# EAGLE design Lightpack5.5L (EAGLE 6.2)
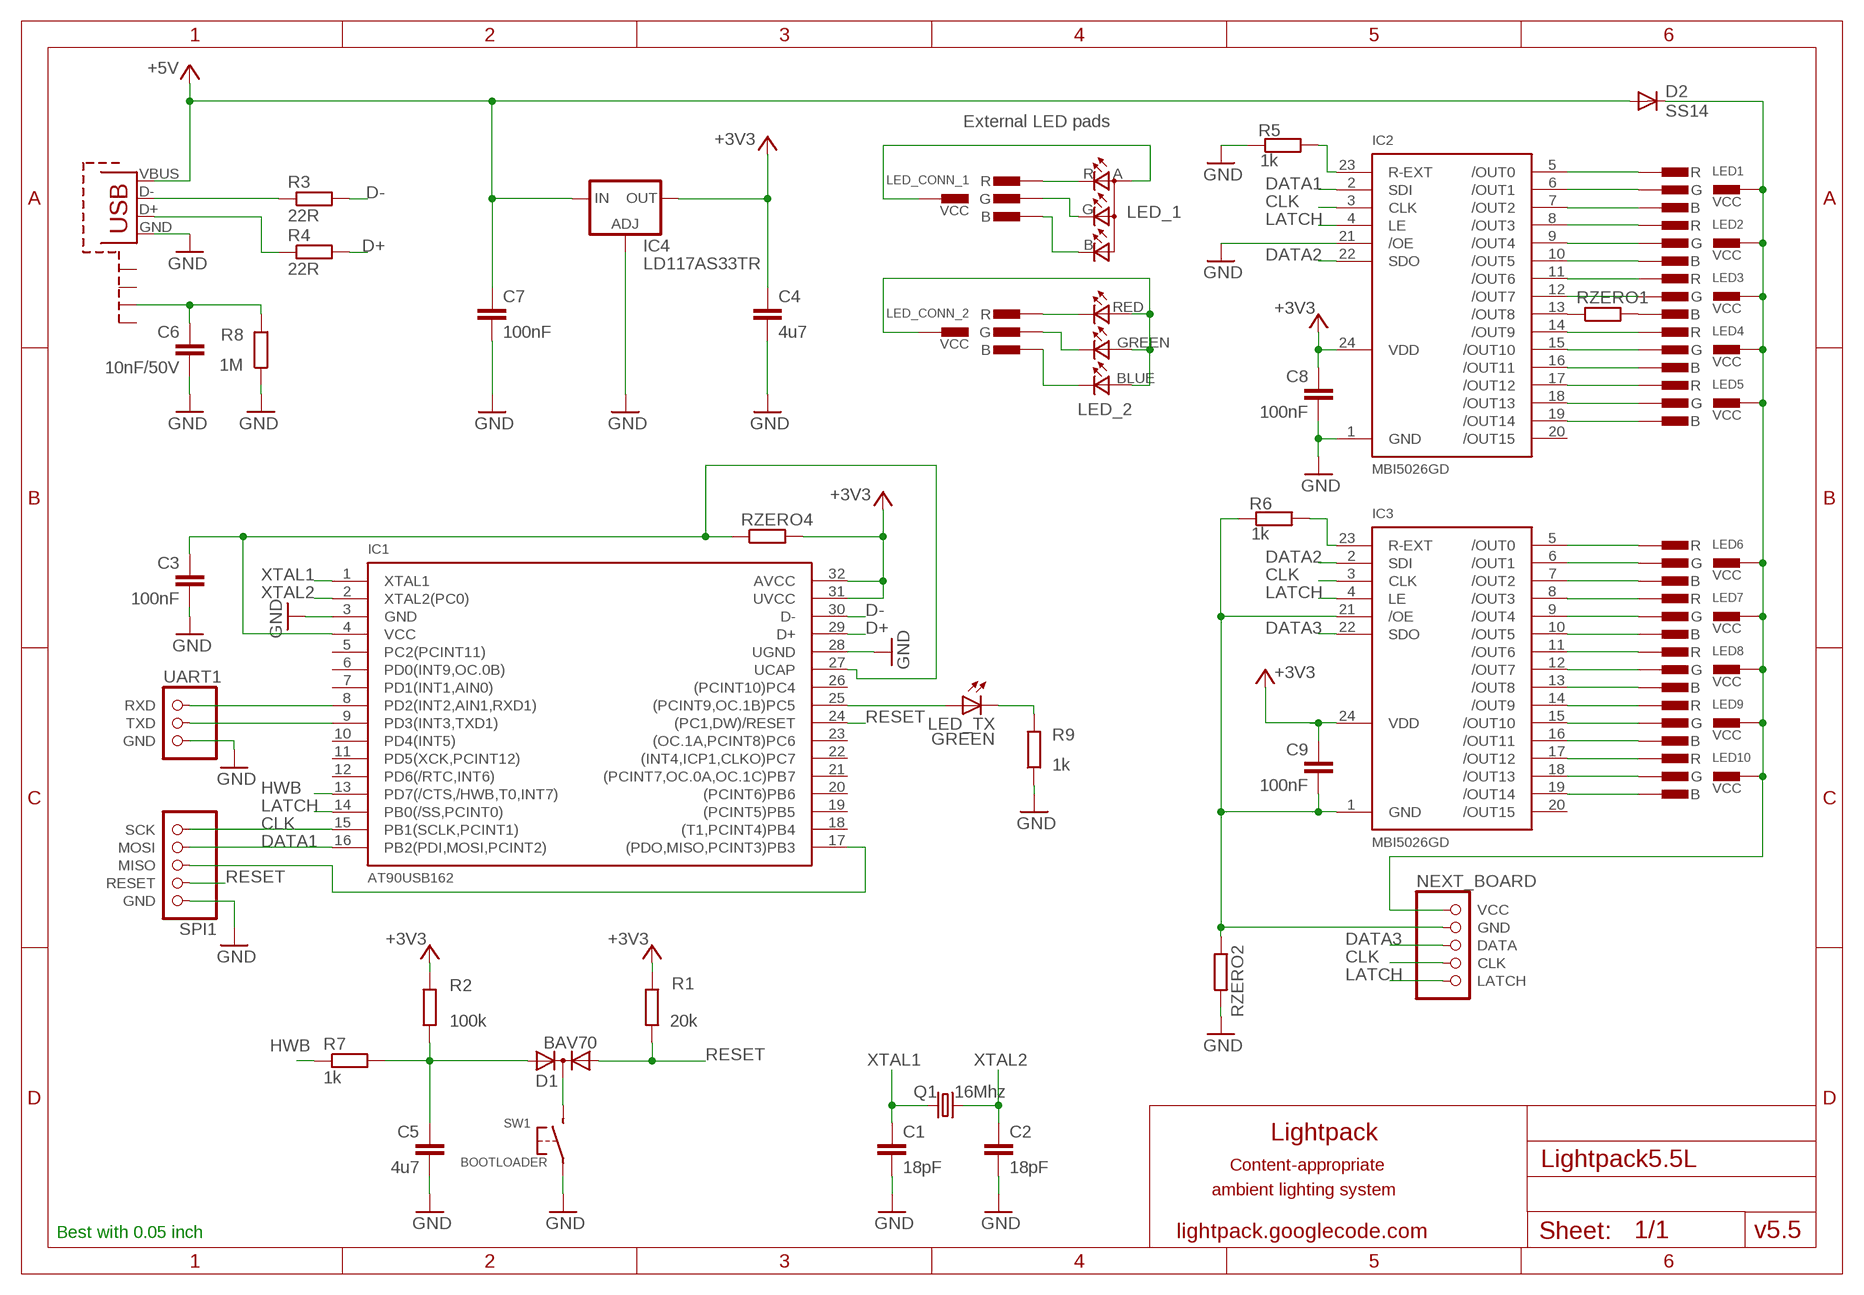
[diagram p0: schematic, sheet 1]

## Parts
C1  18pF  C-EUC1206  [C1206]
C2  18pF  C-EUC1206  [C1206]
C3  100nF  C-EUC1206  [C1206]
C4  4u7  C-EUC1206  [C1206]
C5  4u7  C-EUC1206  [C1206]
C6  10nF/50V  C-EUC1206  [C1206]
C7  100nF  C-EUC1206  [C1206]
C8  100nF  C-EUC1206  [C1206]
C9  100nF  C-EUC1206  [C1206]
D1  BAV70  DIODE-2AC|CASOT23  [SOT23]
D2  SS14  DIODE-SMB  [SMB]
IC1  AT90USB162  [TQFP32]
IC2  MBI5026GD  [SOP24-300-1.27]
IC3  MBI5026GD  [SOP24-300-1.27]
IC4  LD117AS33TR  [SOT223]
LED1  CON-RGB-LED  [CON-RGB-LED]
LED2  CON-RGB-LED  [CON-RGB-LED]
LED3  CON-RGB-LED  [CON-RGB-LED]
LED4  CON-RGB-LEDVCC-INDENT  [CON-RGB-LED-WITH-VCC-INDENT]
LED5  CON-RGB-LEDVCC-INDENT  [CON-RGB-LED-WITH-VCC-INDENT]
LED6  CON-RGB-LED  [CON-RGB-LED]
LED7  CON-RGB-LED  [CON-RGB-LED]
LED8  CON-RGB-LED  [CON-RGB-LED]
LED9  CON-RGB-LED  [CON-RGB-LED]
LED10  CON-RGB-LED  [CON-RGB-LED]
LED_1  CLV1A-FKB  [CLV1A-FKB]
LED_2  TOPLED-3SMD5X5  [SMD-RGB-5X5]
LED_CONN_1  CON-RGB-LED  [CON-RGB-LED]
LED_CONN_2  CON-RGB-LED  [CON-RGB-LED]
LED_TX  GREEN  LEDCHIPLED_0805  [CHIPLED_0805]
NEXT_BOARD  LED_DRIVER_BOARD  [DATA-CLK-LATCH]
Q1  16Mhz  CRYSTALHC49UP  [HC49UP]
R1  20k  R-EU_R1206  [R1206]
R2  100k  R-EU_R1206_2  [R1206]
R3  22R  R-EU_R1206  [R1206]
R4  22R  R-EU_R1206  [R1206]
R5  1k  R-EU_R1206  [R1206]
R6  1k  R-EU_R1206  [R1206]
R7  1k  R-EU_R1206  [R1206]
R8  1M  R-EU_R1206  [R1206]
R9  1k  R-EU_R1206  [R1206]
RZERO1  R-EU_R1206_2  [R1206]
RZERO2  0  R-EU_R1206_2  [R1206]
RZERO4  R-EU_R1206_2  [R1206]
SPI1  SPI_RST_GND_CONN  [SPI_5]
SW1  BOOTLOADER  BUTTON  [BUTTON-SMD]
UART1  UART  [UART]
X1  USB-MB-S  [USB-MB-S]

## Nets
+3V3: C4.1 C8.1 C9.1 IC1.31(UVCC) IC1.32(AVCC) IC2.24(VDD) IC3.24(VDD) IC4.4(OUT) R1.2 R2.1 RZERO4.1
+5V [VCC]: C7.1 D2.A IC4.3(IN) X1.VBUS
CLK: IC1.15(PB1(SCLK,PCINT1)) IC2.3(CLK) IC3.3(CLK) NEXT_BOARD.CLK SPI1.SCK
D+: IC1.29(D+) R4.2
D-: IC1.30(D-) R3.2
DATA1: IC1.16(PB2(PDI,MOSI,PCINT2)) IC2.2(SDI) SPI1.MOSI
DATA2: IC2.22(SDO) IC3.2(SDI)
DATA3: IC3.22(SDO) NEXT_BOARD.DATA
GND: C1.2 C2.2 C3.2 C4.2 C5.2 C6.2 C7.2 C8.2 IC1.3(GND) IC1.28(UGND) IC2.1(GND) IC2.21(/OE) IC4.1(ADJ) R5.1 R8.1 R9.1 RZERO2.1 SPI1.GND SW1.1 UART1.GND X1.GND
HWB: IC1.13(PD7(/CTS,/HWB,T0,INT7)) R7.1
LATCH: IC1.14(PB0(/SS,PCINT0)) IC2.4(LE) IC3.4(LE) NEXT_BOARD.LATCH
N$1: IC2.23(R-EXT) R5.2
N$2: IC3.8(/OUT3) LED7.R
N$3: IC1.17((PDO,MISO,PCINT3)PB3) SPI1.MISO
N$4: IC1.8(PD2(INT2,AIN1,RXD1)) UART1.RXD
N$5: IC2.5(/OUT0) LED1.R
N$6: IC2.6(/OUT1) LED1.G
N$7: IC2.7(/OUT2) LED1.B
N$8: IC1.25((PCINT9,OC.1B)PC5) LED_TX.A
N$9: IC2.8(/OUT3) LED2.R
N$10: IC2.9(/OUT4) LED2.G
N$11: IC2.10(/OUT5) LED2.B
N$12: IC2.11(/OUT6) LED3.R
N$13: IC2.12(/OUT7) LED3.G
N$14: IC2.13(/OUT8) RZERO1.2
N$15: IC2.14(/OUT9) LED4.R
N$16: IC1.9(PD3(INT3,TXD1)) UART1.TXD
N$17: LED_1.R(CRED) LED_CONN_1.R
N$18: IC3.5(/OUT0) LED6.R
N$19: IC3.6(/OUT1) LED6.G
N$20: IC3.7(/OUT2) LED6.B
N$21: IC3.9(/OUT4) LED7.G
N$22: IC3.10(/OUT5) LED7.B
N$23: IC3.11(/OUT6) LED8.R
N$24: IC3.12(/OUT7) LED8.G
N$25: IC3.14(/OUT9) LED9.R
N$26: IC3.13(/OUT8) LED8.B
N$27: IC3.15(/OUT10) LED9.G
N$28: IC3.16(/OUT11) LED9.B
N$29: IC2.15(/OUT10) LED4.G
N$30: IC2.16(/OUT11) LED4.B
N$31: IC3.23(R-EXT) R6.2
N$32: R3.1 X1.D-
N$33: R4.1 X1.D+
N$34: LED_1.G(CGREEN) LED_CONN_1.G
N$35: LED_1.B(CBLUE) LED_CONN_1.B
N$36: LED_1.A(ANODE) LED_CONN_1.VCC
N$37: LED_TX.C R9.2
N$38: IC2.17(/OUT12) LED5.R
N$39: IC2.18(/OUT13) LED5.G
N$40: IC2.19(/OUT14) LED5.B
N$41: IC3.17(/OUT12) LED10.R
N$42: IC3.18(/OUT13) LED10.G
N$43: IC3.19(/OUT14) LED10.B
N$44: C6.1 R8.2 X1.SHIELD3
N$45: D1.3(C) SW1.2
N$47: C5.1 D1.2(A2) R2.2 R7.2
N$48: C9.2 IC3.1(GND) IC3.21(/OE) NEXT_BOARD.GND R6.1 RZERO2.2
N$49: LED3.B RZERO1.1
N$50: LED_2.CRED LED_CONN_2.R
N$51: LED_2.CGREEN LED_CONN_2.G
N$52: LED_2.CBLUE LED_CONN_2.B
N$53: C3.1 IC1.4(VCC) IC1.27(UCAP) RZERO4.2
N$54: LED_2.BLUE LED_2.GREEN LED_2.RED LED_CONN_2.VCC
N$57 [VCC]: D2.C LED1.VCC LED2.VCC LED3.VCC LED4.VCC LED5.VCC LED6.VCC LED7.VCC LED8.VCC LED9.VCC LED10.VCC NEXT_BOARD.VCC
RESET: D1.1(A1) IC1.24((PC1,DW)/RESET) R1.1 SPI1.RESET
XTAL1: C1.1 IC1.1(XTAL1) Q1.1
XTAL2: C2.1 IC1.2(XTAL2(PC0)) Q1.2
Unconnected: IC1.5(PC2(PCINT11)) IC1.6(PD0(INT9,OC.0B)) IC1.7(PD1(INT1,AIN0)) IC1.10(PD4(INT5)) IC1.11(PD5(XCK,PCINT12)) IC1.12(PD6(/RTC,INT6)) IC1.18((T1,PCINT4)PB4) IC1.19((PCINT5)PB5) IC1.20((PCINT6)PB6) IC1.21((PCINT7,OC.0A,OC.1C)PB7) IC1.22((INT4,ICP1,CLKO)PC7) IC1.23((OC.1A,PCINT8)PC6) IC1.26((PCINT10)PC4) IC2.20(/OUT15) IC3.20(/OUT15) X1.SHIELD1 X1.SHIELD2 X1.SHIELD4

## Notes on the sheet
- External LED pads
- Lightpack
- Content-appropriate
- ambient lighting system
- Best with 0.05 inch | lightpack.googlecode.com | v5.5

## Library data of the parts
C1-C9 = rcl:C-EU: CAPACITOR, European symbol
D1 = diode:DIODE-2AC|CA: Dual DIODE Anode-Cathode|Cathode-Anode
D2 = diode:DIODE-: DIODE
IC1 = AT90USB:AT90USB162: AT90USB162 Author: brunql.github.com
IC2 IC3 = MBI5026:MBI5026: MBI5026 Author: brunql.github.com
IC4 = v-reg:LD117A?*: Low drop fixed and adjustable positive voltage regulators 1 A Source: http://www.st.com/stonline/products/literature/ds/7194/ld1117axx.pdf
LED1-LED3 LED6-LED10 LED_CONN_1 LED_CONN_2 = led-rgb:CON-RGB-LED
LED4 LED5 = br-led-rgb:CON-RGB-LED
LED_1 = led-rgb:CLV1A-FKB: Chip LED RGB Source: http://document.sharpsma.com/files/GM1WA55311A_SS.pdf
LED_2 = br-led-rgb:TOPLED-3: OSRAM Edited: brunql Removed center pad in pcb - Hyper Multi TOPLED® (RGB) LB E673, LV E673, LT E673 - Power TOPLED® Enhanced optical Power LED (HOP2000) LS E67B, LA E67B, LO E67B, LY E67B - Hyper Multi TOPLED® Enhanced optical Power LED (HOP2000 / ATON®) LATB T66B - Hyper Multi TOPLED® Hyper-Bright LED LATB T686 Source: http://www.osram.convergy.de/
LED_TX = led:LED: LED OSRAM: - CHIPLED LG R971, LG N971, LY N971, LG Q971, LY Q971, LO R971, LY R971 LH N974, LH R974 LS Q976, LO Q976, LY Q976 LO Q996 - Hyper CHIPLED LW Q18S LB Q993, LB Q99A, LB R99A - SideLED LS A670, LO A670, LY A670, LG A670, LP A670 LB A673, LV A673, LT A673, LW A673 LH A674 LY A675 LS A676, LA A676, LO A676, LY A676, LW A676 LS A679, LY A679, LG A679 - Hyper Micro SIDELED® LS Y876, LA Y876, LO Y876, LY Y876 LT Y87S - SmartLED LW L88C, LW L88S LB L89C, LB L89S, LG L890 LS L89K, LO L89K, LY L89K LS L896, LA L896, LO L896, LY L896 - TOPLED LS T670, LO T670, LY T670, LG T670, LP T670 LSG T670, LSP T670, LSY T670, LOP T670, LYG T670 LG T671, LOG T671, LSG T671 LB T673, LV T673, LT T673, LW T673 LH T674 LS T676, LA T676, LO T676, LY T676, LB T676, LH T676, LSB T676, LW T676 LB T67C, LV T67C, LT T67C, LS T67K, LO T67K, LY T67K, LW E67C LS E67B, LA E67B, LO E67B, LY E67B, LB E67C, LV E67C, LT E67C LW T67C LS T679, LY T679, LG T679 LS T770, LO T770, LY T770, LG T770, LP T770 LB T773, LV T773, LT T773, LW T773 LH T774 LS E675, LA E675, LY E675, LS T675 LS T776, LA T776, LO T776, LY T776, LB T776 LHGB T686 LT T68C, LB T68C - Hyper Mini TOPLED® LB M676 - Mini TOPLED Santana® LG M470 LS M47K, LO M47K, LY M47K Source: http://www.osram.convergy.de LUXEON: - LUMILED® LXK2-PW12-R00, LXK2-PW12-S00, LXK2-PW14-U00, LXK2-PW14-V00 LXK2-PM12-R00, LXK2-PM12-S00, LXK2-PM14-U00 LXK2-PE12-Q00, LXK2-PE12-R00, LXK2-PE12-S00, LXK2-PE14-T00, LXK2-PE14-U00 LXK2-PB12-K00, LXK2-PB12-L00, LXK2-PB12-M00, LXK2-PB14-N00, LXK2-PB14-P00, LXK2-PB14-Q00 LXK2-PR12-L00, LXK2-PR12-M00, LXK2-PR14-Q00, LXK2-PR14-R00 LXK2-PD12-Q00, LXK2-PD12-R00, LXK2-PD12-S00 LXK2-PH12-R00, LXK2-PH12-S00 LXK2-PL12-P00, LXK2-PL12-Q00, LXK2-PL12-R00 Source: www.luxeon.com KINGBRIGHT: KA-3528ASYC Source: www.kingbright.com
NEXT_BOARD = br-connectors:LED_DRIVER_BOARD: PIN HEADER
Q1 = crystal:CRYSTAL: CRYSTAL; OC_FARNELL: unknown; OC_NEWARK: unknown
R1 R2 R5 R6 RZERO1 RZERO2 RZERO4 = br-zero-res:R-EU_: RESISTOR, European symbol
R3 R4 R7-R9 = rcl:R-EU_: RESISTOR, European symbol
SPI1 = br-connectors:SPI_RST_GND_CONN: PIN HEADER
SW1 = button-smd:BUTTON: Button SMD
UART1 = br-connectors:UART: PIN HEADER
X1 = USB_miniB:USB: USB Connector miniUSB type B

## Net classes
1 VCC: width 0.6 mm, clearance 0.6 mm

## Board
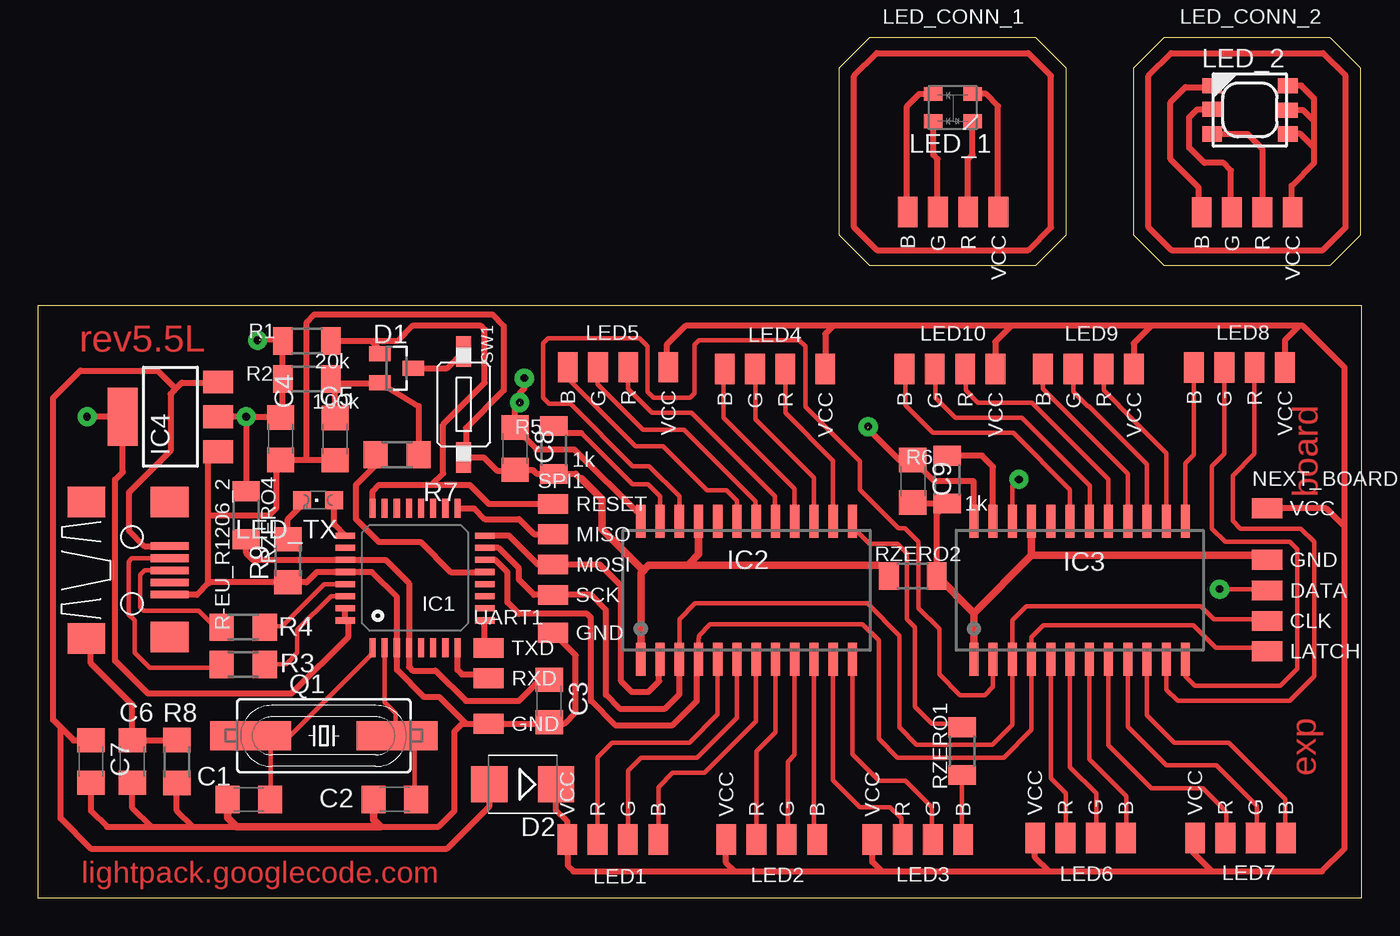
[diagram p1: board, top side]
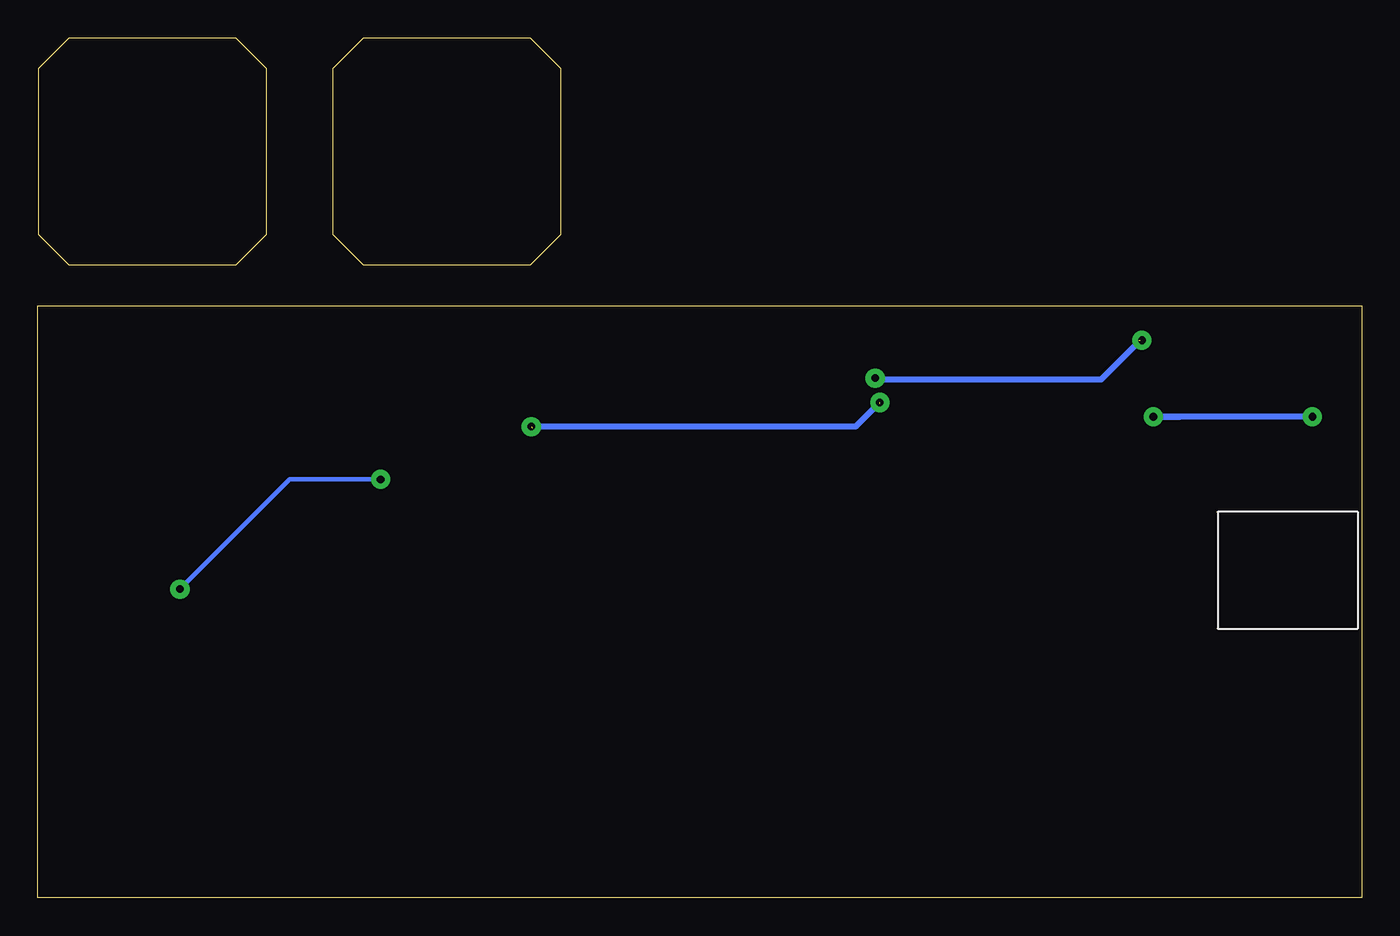
[diagram p2: board, bottom side, seen from below]

Size 87.38 x 56.75 mm. Coordinates in mm from the lower left corner, seen from the top.
Outline: 0,0 87.38,0 87.38,39.06 0,39.06 0,0
Outline: 52.88,43.75 54.88,41.75 65.88,41.75 67.88,43.75 67.88,54.75 65.88,56.75 54.88,56.75 52.88,54.75 52.88,43.75
Outline: 72.31,43.75 74.31,41.75 85.31,41.75 87.31,43.75 87.31,54.75 85.31,56.75 74.31,56.75 72.31,54.75 72.31,43.75
Copper layers (1*16): Top 0.035mm / dielectric 1.5mm / Bottom 0.035mm
Design rules: minimum track width 10mil, minimum drill 24mil, track to track 8mil, track to pad 8mil, pad to pad 8mil, via to via 8mil, smd to smd 8mil, copper to edge 40mil, drill to drill 8mil, minimum pad ring 10mil, minimum via ring 8mil, stop-mask expansion 4mil, vias tented up to drill 0mil, thermal gap 10mil

### Footprints (pad centres in the part's own frame; a part is rotated, then mirrored left to right if it is on the bottom)
C1206 = smd 1.6 x 1.8: 1 -1.4,0; 2 1.4,0
SOT23 = smd 1 x 1.4: 1 -0.95,-1.1; 2 0.95,-1.1; 3 0,1.1
SMB = smd 2.4 x 2.4: A 2.2,0; C -2.2,0
TQFP32 = smd 1.27 x 0.4: 1 -4.61,2.82; 2 -4.61,2.02; 3 -4.61,1.22; 4 -4.61,0.42; 5 -4.61,-0.38; 6 -4.61,-1.18; 7 -4.61,-1.98; 8 -4.61,-2.78; 17 4.59,-2.78; 18 4.59,-1.98; 19 4.59,-1.18; 20 4.59,-0.38; 21 4.59,0.42; 22 4.59,1.22; 23 4.59,2.02; 24 4.59,2.82 | smd 0.4 x 1.27: 9 -2.81,-4.58; 10 -2.01,-4.58; 11 -1.21,-4.58; 12 -0.41,-4.58; 13 0.39,-4.58; 14 1.19,-4.58; 15 1.99,-4.58; 16 2.79,-4.58; 25 2.79,4.62; 26 1.99,4.62; 27 1.19,4.62; 28 0.39,4.62; 29 -0.41,4.62; 30 -1.21,4.62; 31 -2.01,4.62; 32 -2.81,4.62
SOP24-300-1.27 = smd 0.6 x 2.2: 1 -6.85,-4.635; 2 -5.58,-4.635; 3 -4.31,-4.635; 4 -3.04,-4.635; 5 -1.77,-4.635; 6 -0.5,-4.635; 7 0.77,-4.635; 8 2.04,-4.635; 9 3.31,-4.635; 10 4.58,-4.635; 11 5.85,-4.635; 12 7.12,-4.635; 13 7.12,4.47; 14 5.85,4.47; 15 4.58,4.47; 16 3.31,4.47; 17 2.04,4.47; 18 0.77,4.47; 19 -0.5,4.47; 20 -1.77,4.47; 21 -3.04,4.47; 22 -4.31,4.47; 23 -5.58,4.47; 24 -6.85,4.47
SOT223 = smd 1.5 x 2: 1 -2.3,-3.15; 2 0,-3.15; 3 2.3,-3.15 | smd 3.8 x 2: 4 0,3.15
CON-RGB-LED = smd 2 x 1.3: B 0,-3; G 0,-1; R 0,1; VCC 0,3
CON-RGB-LED-WITH-VCC-INDENT = smd 2 x 1.3: B 0,-3; G 0,-1; R 0,1; VCC 0,3.635
CLV1A-FKB = smd 1.2 x 0.9: A 0.4,-0.4; B 3,-0.4; G 3,1.4; R 0.4,1.4
SMD-RGB-5X5 = smd 1.3 x 1: BLUE 2.5,1.6; CBLUE -2.5,1.6; CGREEN -2.5,0.037; CRED -2.5,-1.587; GREEN 2.5,-0.025; RED 2.5,-1.587
CHIPLED_0805 = smd 1.2 x 1.2: A 0,-1.05; C 0,1.05
DATA-CLK-LATCH = smd 2 x 1.3: CLK 0,-1.905; DATA 0,0.095; GND 0,2.127; LATCH 0,-3.905; VCC 0,5.524
HC49UP = smd 5.334 x 1.93: 1 -4.826,0; 2 4.826,0
R1206 = smd 1.3 x 1.803: 1 -1.581,0; 2 1.581,0
R1206' = smd 1.6 x 1.803: 1 -1.422,0; 2 1.422,0
SPI_5 = smd 2 x 1.3: GND 0,-4.5; MISO 0,2; MOSI 0,0; RESET 0,4; SCK 0,-2
BUTTON-SMD = smd 2 x 1: 1 -3.5,0; 2 3.5,0
UART = smd 2 x 1.3: GND 0,-3.01; RXD 0,0; TXD 0,2
USB-MB-S = smd 2.5 x 0.5: D+ 2.5,0; D- 2.5,0.8; GND 2.5,-1.6; ID 2.5,-0.8; VBUS 2.5,1.6 | smd 2.5 x 2: SHIELD1 2.5,4.5; SHIELD2 -3,4.5; SHIELD3 -3,-4.5; SHIELD4 2.5,-4.4

### Placement (x,y rotation side)
C1  13.94,6.5 180 top
C2  23.56,6.5 180 top
C3  33.75,13 270 top
C4  16.02,30.3 270 top
C5  19.61,30.28 270 top
C6  6.24,9 270 top
C7  3.5,9 270 top
C8  31.5,29.65 270 top
C9  57.75,27.5 270 top
D1  23.68,34.95 270 top
D2  32,7.5 180 top
IC1  24.91,21.12 90 top
IC2  46.65,20.39 0 top
IC3  68.63,20.39 0 top
IC4  8.75,31.75 90 top
LED1  37.95,3.86 90 top
LED2  48.44,3.86 90 top
LED3  58.08,3.86 90 top
LED4  48.34,34.9 270 top
LED5  37.97,35.02 270 top
LED6  68.81,3.96 90 top
LED7  79.38,3.96 90 top
LED8  79.31,35 270 top
LED9  69.34,34.9 270 top
LED10  60.2,34.9 270 top
LED_1  62.09,52.65 180 top
LED_2  80,52 0 top
LED_CONN_1  60.41,45.27 270 top
LED_CONN_2  79.81,45.25 270 top
LED_TX  18.5,26.25 90 top
NEXT_BOARD  81.12,20.19 0 top
Q1  18.88,10.71 0 top
R1  17.75,36.75 180 top
R2  17.75,34.25 0 top
R3  22R  [R1206']  13.56,15.41 0 top
R4  22R  [R1206']  13.56,17.87 0 top
R5  34.05,29.55 90 top
R6  60.01,27.6 90 top
R7  1k  [R1206']  23.71,29.25 0 top
R8  1M  [R1206']  9.18,9 90 top
R9  1k  [R1206']  16.5,22.25 90 top
RZERO1  61,9.69 90 top
RZERO2  57.75,21.25 0 top
RZERO4  13.75,25.25 270 top
SPI1  34,22 0 top
SW1  28.11,32.56 90 top
UART1  29.75,14.5 0 top
X1  6.21,21.62 0 top

### Tracks (layer width: path | path; a pad name or v marks a point on that pad's centre or on a via)
+3V3  (via drill 0.5 pad 1.27)  (3 unrouted)
  Top 0.406: IC1.31 IC1.32 20.5,18.1 20.5,17.25 16.75,13.5 7.25,13.5 5.1,15.65 5.1,27.6 5.6,28.1 IC4.4 v3.25,31.75 | 12.29,31.7 12.25,31.75 v13.75,31.75 | IC2.24 39.8,25.2 35.4,29.6 32.9,29.6 31.5,31 C8.1 31.5,32.3 31.8,32.6 | v13.75,31.75 15.98,31.75 C4.1 16.17,31.85 R2.1 R1.2 16.25,36.83 14.73,36.83 14.7,36.8 | v13.75,31.75 RZERO4.1 | IC3.24 61.78,27.47 61.75,27.5 59.15,27.5 C9.1 56.85,28.9 54.75,31 | v31.8,32.7 31.8,33.3 32.1,33.6 v32.1,34.3
  Bottom 0.406: v3.25,31.75 v13.75,31.75 12,31.75 | v54.8,31.1 33.4,31.1 v31.8,32.7 | v14.5,36.8 14.6,36.8 17.2,34.2 32,34.2 v32.1,34.3
+5V
  Top 0.406: D2.A 29.8,6.05 27,3.25 3.5,3.25 1.5,5.25 1.5,11.25 | 8.67,23.25 X1.VBUS 7.03,23.22 6,24.25 6,26.75 8.75,29.5 8.75,33.25 9,33.5 | 9,33.5 9.5,34 11.85,34 IC4.3 | C7.1 2.35,10.4 1.5,11.25 | 9,33.5 9,33.7 7.9,34.8 2.8,34.8 1,33 1,11.75 1.5,11.25
CLK
  Top 0.305: IC2.3 42.34,18.4 43.38,19.44 54.75,19.44 56.88,17.31 56.88,11.25 58,10.12 63,10.12 64.32,11.45 IC3.3 64.32,18.32 65.25,19.25 76.75,19.25 77.62,18.38 81.03,18.38 NEXT_BOARD.CLK
  Top 0.406: IC1.15 30.39,23.11 31.75,21.75 31.75,21 32.75,20 SPI1.SCK 36.5,20 37.5,19 37.5,13.4 38.4,12.5 41.4,12.5 42.34,13.44 IC2.3
D+
  Top 0.305: IC1.29 18.89,20.71 16.12,17.94 14.92,17.94
  Top 0.406: 14.92,17.94 14.92,17.93 R4.2
D-
  Top 0.305: IC1.30 19.34,19.91 17.12,17.69 17.12,16.19 16.38,15.44 14.96,15.44
  Top 0.406: R3.2 14.96,15.44
DATA1
  Top 0.406: IC2.2 41,15.69 41,14.3 40.3,13.6 39.2,13.6 38.5,14.3 38.5,20.6 37.1,22 SPI1.MOSI 33,22 31.09,23.91 IC1.16
DATA2
  Top 0.305: IC3.2 63.05,13.93 62.5,13.38 60.88,13.38 59.5,14.75 59.5,17.75 58.12,19.12 58.12,23.5 57.23,24.4 56.8,24.4 54.25,26.95 54.25,28.8 50.65,32.4 50.65,36.4 50.24,36.81 46,36.81 45.99,36.8 43.65,36.8 43.35,36.5 43.35,33.3 43.05,33 40.65,33 40.25,33.4 40.25,36.4 39.71,36.94 33.69,36.94 33.35,36.6 33.35,33 33.75,32.6 35.15,32.6 39.25,28.5 40.35,28.5 42.35,26.5 42.35,24.87 IC2.22
DATA3  (via drill 0.5 pad 1.27)
  Top 0.305: IC3.22 64.32,27.2 v64.75,27.62 | v78,20.38 81.03,20.38 NEXT_BOARD.DATA
  Bottom 0.305: v64.75,27.62 70.75,27.62 v78,20.38
GND
  Top 0.305: 39.8,21.77 39.8,21.44 | 42.88,21.94 42.91,21.97 | 55.45,21.97 RZERO2.1 | 22.62,4.69 22.64,4.7
  Top 0.406: 22.64,4.7 26.45,4.7 27.5,5.75 27.5,11 27.99,11.49 28.26,11.49 | 17.75,28.91 C4.2 15.75,28.63 15.75,25.75 15.25,25.25 11.25,25.25 | 17.75,28.91 19.59,28.91 C5.2 | 28.26,11.49 UART1.GND 33.25,11.49 | 28.26,11.49 26.5,13.25 25.5,13.25 23.7,15.05 IC1.3 23.7,19.87 22.05,21.51 IC1.28 18.4,21.5 17.73,20.83 R9.1 11.33,20.83 11.25,20.75 | 7.5,4.69 4.56,4.69 3.5,5.75 C7.2 | 7.5,4.69 10.25,4.69 | 10.25,4.69 13.12,4.69 | C6.2 6.24,5.95 7.5,4.69 | R8.1 9.18,5.76 10.25,4.69 | 33.25,11.49 33.64,11.49 C3.2 | SPI1.GND 35.5,16 35.5,12.25 34.75,11.5 33.26,11.5 33.25,11.49 | 11.25,25.25 11.25,28.8 IC4.1 | 17.75,28.91 17.75,38 18.25,38.5 30,38.5 30.75,37.75 30.75,33.5 28.25,31 28.25,29.21 SW1.1 29.43,29.07 30.3,28.2 31.45,28.2 C8.2 32.65,28.25 32.9,28 34.03,28 R5.1 34.08,28 35.5,28 35.83,27.67 35.88,27.67 | 11.25,20.75 11.25,25.25 | 11.25,20.75 10.5,20 8.72,20 X1.GND
  Top 0.5: IC2.1 39.8,21.44 40.3,21.94 42.88,21.94 | C1.2 12.54,5.28 13.12,4.69 22.62,4.69 22.16,5.15 C2.2 | IC2.21 43.6,22.67 42.91,21.97 55.45,21.97 | 39.8,21.77 37.25,24.31 37.25,26.3 35.88,27.67
HWB
  Top 0.406: IC1.13 27.25,21.5 25.25,23.5 22.5,23.5 21,25 21,27.25 22.29,28.54 R7.1
LATCH
  Top 0.305: IC2.4 43.6,17.11 43.62,17.12 43.62,17.31 44.38,18.06 54.44,18.06 55.5,17 55.5,10.5 56.75,9.25 63.75,9.25 65.59,11.09 IC3.4 65.59,17.21 66.38,18 76.25,18 77.75,16.5 80.91,16.5 NEXT_BOARD.LATCH
  Top 0.406: IC1.14 30.19,22.31 31,21.5 31,19.5 31.75,18.75 36.25,18.75 36.5,18.5 36.5,13 38.1,11.4 41.9,11.4 43.5,13 43.5,15.65 IC2.4
N$1
  Top 0.305: IC2.23 41.06,26.51 40.27,27.3 39.25,27.3 35.87,30.68 | R5.2 34.06,30.68
  Top 0.406: 35.87,30.68 34.31,30.68 R5.2
N$2
  Top 0.305: IC3.8 70.67,10.08 73.5,7.25 76.9,7.25 78.45,5.7 78.45,4.03 LED7.R 78,3.88
N$3
  Top 0.305: IC1.17 27.7,26.01
  Top 0.406: IC1.17 28.79,25.71 29.5,25 31.75,25 32.75,24 SPI1.MISO
N$4
  Top 0.406: IC1.8 27.7,15.05 28,14.75 29.5,14.75 UART1.RXD
N$5
  Top 0.305: IC2.5 44.88,12.12 43,10.25 37.9,10.25 36.95,9.3 LED1.R
N$6
  Top 0.305: IC2.6 46.15,11.89 43.5,9.25 39.8,9.25 38.95,8.4 LED1.G
N$7
  Top 0.305: IC2.7 47.41,11.66 44,8.25 41.9,8.25 40.95,7.3 LED1.B
N$8
  Top 0.406: LED_TX.A 19.55,24.65 IC1.25
N$9
  Top 0.305: LED2.R 47.44,9.69 48.69,10.94 IC2.8
N$10
  Top 0.305: IC2.9 49.95,9.46 49.5,9 49.5,3.92 LED2.G
N$11
  Top 0.305: IC2.10 51.23,4.07 LED2.B
N$12
  Top 0.305: IC2.11 52.49,7.75 54.25,6 56.25,6 57,5.25 57,3.93 LED3.R
N$13
  Top 0.305: IC2.12 53.77,9.48 55.5,7.75 57.25,7.75 59,6 59,3.93 LED3.G
N$14
  Top 0.305: IC2.13 53.77,24.48 54.88,23.38 56.75,23.38 57.38,22.75 57.38,18.38 57.88,17.88 57.88,12.62 59,11.5 60.77,11.5 RZERO1.2
N$15
  Top 0.305: IC2.14 52.49,28.86 49.35,32 49.35,34.88 LED4.R
N$16
  Top 0.406: IC1.9 29.5,16.75 UART1.TXD
N$17
  Top 0.406: LED_1.R 61.7,49.07 61.38,48.75 61.38,45.3 LED_CONN_1.R
N$18
  Top 0.305: IC3.5 66.86,7.89 67.85,6.9 67.85,3.99 LED6.R
N$19
  Top 0.305: IC3.6 68.13,8.62 69.85,6.9 69.85,3.99 LED6.G
N$20
  Top 0.305: IC3.7 69.4,9.15 71.85,6.7 71.85,3.99 LED6.B
N$21
  Top 0.305: IC3.9 71.94,11.31 74.5,8.75 77.8,8.75 80.45,6.1 80.45,4.03 LED7.G 80,3.88
N$22
  Top 0.305: IC3.10 73.21,12.04 75,10.25 78.6,10.25 82.35,6.5 82.35,3.99 LED7.B 82,3.88
N$23
  Top 0.305: IC3.11 74.5,15.73 74.5,13.75 75.25,13 82.62,13 84.25,14.62 84.25,23.5 83.38,24.38 79.38,24.38 78.88,24.88 78.88,27.88 80.31,29.3 LED8.R
N$24
  Top 0.305: IC3.12 75.75,14.62 76.38,14 82,14 83.12,15.12 83.12,23 82.62,23.5 78.38,23.5 77.5,24.38 77.5,28.5 78.31,29.3 LED8.G
N$25
  Top 0.305: IC3.14 74.48,29.33 71.34,32.47 71.34,32.51 70.35,33.5 70.35,34.89 LED9.R
N$26
  Top 0.305: IC3.13 75.75,28.69 76.31,29.24 LED8.B
N$27
  Top 0.305: IC3.15 73.21,28.6 69.38,32.44 69.31,32.44 68.35,33.4 68.35,34.89 LED9.G
N$28
  Top 0.305: LED9.B 66.35,34.89 66.35,33.6 71.95,28 IC3.16
N$29
  Top 0.305: IC2.15 51.23,27.73 47.35,31.6 47.35,34.88 LED4.G
N$30
  Top 0.305: IC2.16 49.95,27 45.25,31.7 45.25,34.81 LED4.B
N$31
  Top 0.406: R6.2 62.32,29.18 63.05,28.45 IC3.23
N$32
  Top 0.305: 11.86,15.19 7.38,15.19 6.38,16.19 6.38,18.32 6,18.7 6,22.2 6.2,22.4 8.69,22.4 X1.D-
  Top 0.406: 11.86,15.19 11.92,15.19 R3.1
N$33
  Top 0.305: 11.68,17.88 10.62,18.94 7,18.94 6.75,19.19 6.75,21.31 7.05,21.62 X1.D+
  Top 0.406: 11.68,17.88 12.12,17.88 R4.1
N$34
  Top 0.406: LED_1.G 59.09,49.03 59.38,48.75 59.38,45.3 LED_CONN_1.G
N$35
  Top 0.406: LED_1.B 58.17,53.05 57.38,52.25 57.38,45.3 LED_CONN_1.B
N$36
  Top 0.406: LED_1.A 62.58,53.05 63.38,52.25 63.38,45.3 LED_CONN_1.VCC
N$37
  Top 0.406: LED_TX.C 17.45,25.95 16.5,25 R9.2
N$38
  Top 0.305: 48.62,24.92 IC2.17 48.65,24.89 48.65,26.5 43.15,32 40.55,32 38.95,33.6 38.95,35 LED5.R
N$39
  Top 0.305: IC2.18 47.38,24.9 47.38,26.19 42.66,30.9 39.95,30.9 36.95,33.9 36.95,35 LED5.G
N$40
  Top 0.305: IC2.19 46.12,24.88 | LED5.B 34.95,35 34.95,34.3 39.45,29.8 41.25,29.8 44.15,26.9 45.45,26.9 46.15,26.2 IC2.19 | IC2.19 46.05,24.95
N$41
  Top 0.305: IC3.17 70.67,27.64 65.62,32.69 62.06,32.69 61.25,33.5 61.25,34.85 LED10.R
N$42
  Top 0.305: IC3.18 69.45,24.91 69.45,27.2 64.96,31.69 60.56,31.69 59.25,33 59.25,34.85 LED10.G
N$43
  Top 0.305: IC3.19 68.13,26.93 64.38,30.69 59.06,30.69 57.25,32.5 57.25,34.85 LED10.B
N$44
  Top 0.406: R8.2 6.26,10.42 C6.1 6.24,12.77 3.5,15.5 3.5,16.82 X1.SHIELD3
N$45
  Top 0.406: D1.3 27,34.95 SW1.2
N$46
  Top 0.406: 53.88,54.25 55.38,55.75 65.38,55.75 66.88,54.25 66.88,44.25 65.38,42.75 55.38,42.75 53.88,44.25 53.88,54.25
N$47
  Top 0.406: C5.1 19.61,33.97 | 19.61,33.97 R2.2 | R7.2 25.14,32.45 D1.2 22.54,33.97 19.61,33.97
N$48
  Top 0.305: 80.83,22.61 NEXT_BOARD.GND
  Top 0.406: RZERO2.2 59.33,25.34 R6.1 57.83,26.02 C9.2
  Top 0.5: 61.78,18.8 RZERO2.2 | IC3.1 61.78,18.8 | 61.78,18.8 65.59,22.61 | 65.59,22.61 IC3.21 | 65.59,22.61 80.83,22.61
N$49
  Top 0.305: RZERO1.1 61,3.93 LED3.B
N$50
  Top 0.406: LED_2.CRED 79.84,50.41 80.81,49.44 LED_CONN_2.R
N$51
  Top 0.406: LED_2.CGREEN 76.54,52.04 76,51.5 76,49.5 77,48.5 78.25,48.5 78.75,48 78.75,45.31 LED_CONN_2.G
N$52
  Top 0.406: LED_CONN_2.B 76.62,45.44 76.62,46.88 74.75,48.75 74.75,52.5 75.75,53.5 77.4,53.5 LED_2.CBLUE
N$53
  Top 0.406: C3.1 33.15,14.4 31.75,13 28.25,13 26.25,15 24.75,15 24.5,15.25 IC1.4 | IC1.4 | RZERO4.2 13.75,22.75 14.19,22.31 IC1.27 22,22.31 22.94,22.31 24.5,20.75 IC1.4
N$54
  Top 0.406: LED_2.BLUE 83.4,53.6 84.25,52.75 84.25,51.25 | 84.25,49.5 84.25,48.5 82.75,47 82.75,45.31 LED_CONN_2.VCC | 84.25,49.5 84.25,51.25 | LED_2.GREEN 83.53,51.98 84.25,51.25 | LED_2.RED 83.34,50.41 84.25,49.5
N$55
  Top 0.406: 73.31,54.25 74.81,55.75 84.81,55.75 86.31,54.25 86.31,44.25 84.81,42.75 74.81,42.75 73.31,44.25 73.31,54.25
N$57
  Top 0.406: 46,1.75 55.7,1.75 | 55.7,1.75 66.75,1.75 | 66.75,1.75 77.5,1.75 | 86.25,24.5 86.25,3.25 84.75,1.75 77.5,1.75 | 86.25,24.5 86.25,35 83.5,37.75 83.25,37.75 | 83.25,37.75 73.5,37.75 | 73.5,37.75 64.25,37.75 | 64.25,37.75 52.5,37.75 | 52.5,37.75 42.75,37.75 41.5,36.5 41.5,35.13 LED5.VCC | LED4.VCC 51.97,37.22 52.5,37.75 | LED10.VCC 63.2,36.7 64.25,37.75 | LED9.VCC 72.34,36.59 73.5,37.75 | LED8.VCC 82.31,36.8 83.25,37.75 | NEXT_BOARD.VCC 85.04,25.71 86.25,24.5 | 77.5,1.75 76.25,3 76.25,3.83 LED7.VCC | LED6.VCC 65.81,2.69 66.75,1.75 | LED2.VCC 45.44,2.31 46,1.75 | D2.C 34.2,5.8 34.95,5.05 LED1.VCC 35,3.8 35,2.1 35.35,1.75 46,1.75 | LED3.VCC 55.08,2.38 55.7,1.75
RESET
  Top 0.406: IC1.24 22.09,26.84 22.5,27.25 26,27.25 | 22,36.75 23.73,36.75 24.73,37.75 29.25,37.75 29.5,37.5 29.5,34 26.75,31.25 26.75,28 26,27.25 | 22,36.75 R1.1 | 26,27.25 28.5,27.25 29.75,26 SPI1.RESET | D1.1 22.58,36.17 22,36.75
XTAL1
  Top 0.305: 15.38,10.44 14.32,10.44 Q1.1 15.11,10.71 15.38,10.44 | 15.38,10.44 16.38,10.44 22.09,16.16 IC1.1 | 15.38,10.44 15.38,6.54 C1.1
XTAL2
  Top 0.305: C2.1 24.88,6.59 24.88,10.69 24.86,10.71 Q1.2 23.62,10.78 23.62,12.19 22.89,12.92 IC1.2

### Text on the board
Top: rev5.5L | board | exp | lightpack.googlecode.com